# EAGLE design BackscatterPlantSensor_v6_4tssop_coax_2layer (EAGLE 6.4)

## Sheet 1 of 4
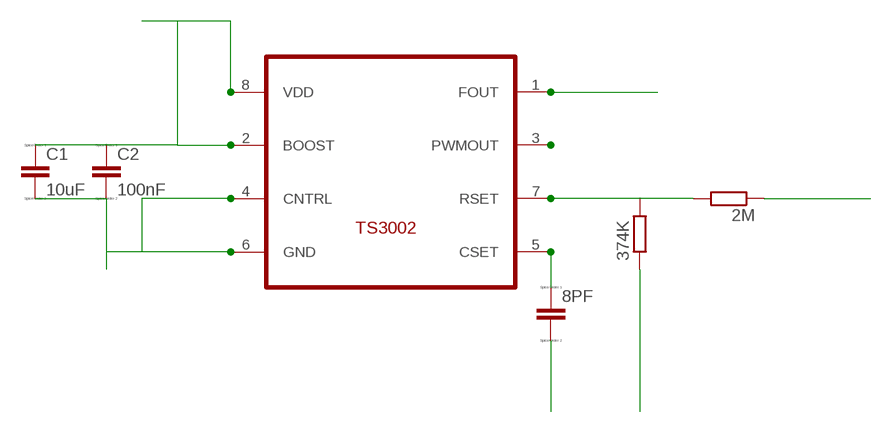
[diagram p0: schematic, sheet 1]

### Parts
2M  R-EU_R0603  [R0603]
8PF  CC0603  [C0603]
374K  R-EU_R0603  [R0603]
C1  10uF  CC0603  [C0603]
C2  100nF  CC0603  [C0603]
U$1  TS3002  [TDFN22-8]

### Nets
AGND: 374K.1 ; also sheet 4
DGND: 8PF.2 C1.2 C2.2 U$1.4(CNTRL) U$1.6(GND) ; also sheet 2
FOUT: U$1.1(FOUT) ; also sheet 2
N$1: 8PF.1 U$1.5(CSET)
N$2: 2M.2 374K.2 U$1.7(RSET)
N$21: U$1.3(PWMOUT)
VCOND1: 2M.1 ; also sheet 4
VDD: C1.1 C2.1 U$1.2(BOOST) U$1.8(VDD) ; also sheet 3,4

## Sheet 2 of 4
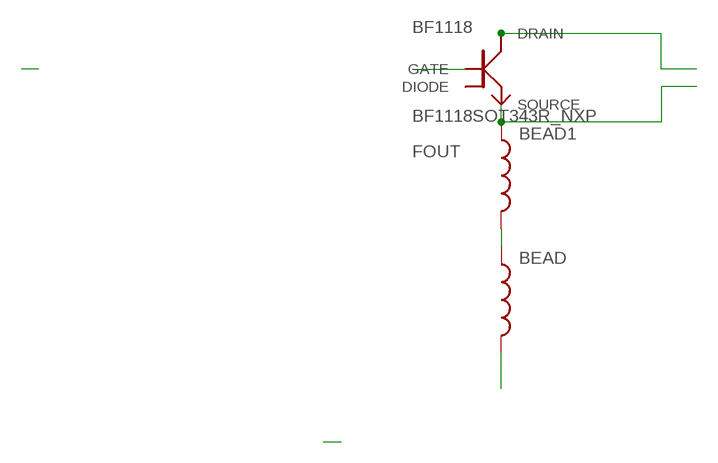
[diagram p1: schematic, sheet 2]

### Parts
BEAD  INDUCTOR0402  [C0402]
BEAD1  INDUCTOR0402  [C0402]
BF1118  BF1118SOT343R_NXP  [SOT343R]

### Nets
DGND: BF1118.1(GATE) ; also sheet 1
FOUT: BEAD.2 ; also sheet 1
N$3: BEAD1.2 BEAD.1
RF_MINUS: BEAD1.1 BF1118.3(SOURCE)
RF_PLUS: BF1118.4(DRAIN)
Unconnected: BF1118.2(DIODE)

## Sheet 3 of 4
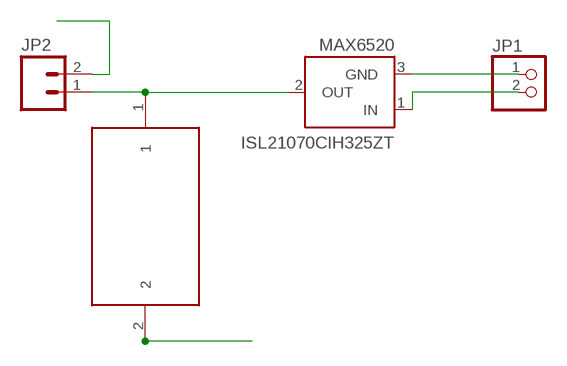
[diagram p2: schematic, sheet 3]

### Parts
ISL21070CIH325ZT  MAX6520  [SOT23]
JP1  PINHD-1X2  [1X02]
JP2  M02PTH  [1X02]
U$2  RVB0E221MNG  [CAP_ELECTROLYTIC]

### Nets
220UF: ISL21070CIH325ZT.2(OUT) JP2.1 U$2.1
GND: ISL21070CIH325ZT.3(GND) JP1.1 U$2.2
N$4: ISL21070CIH325ZT.1(IN) JP1.2
VDD: JP2.2 ; also sheet 1,4

## Sheet 4 of 4
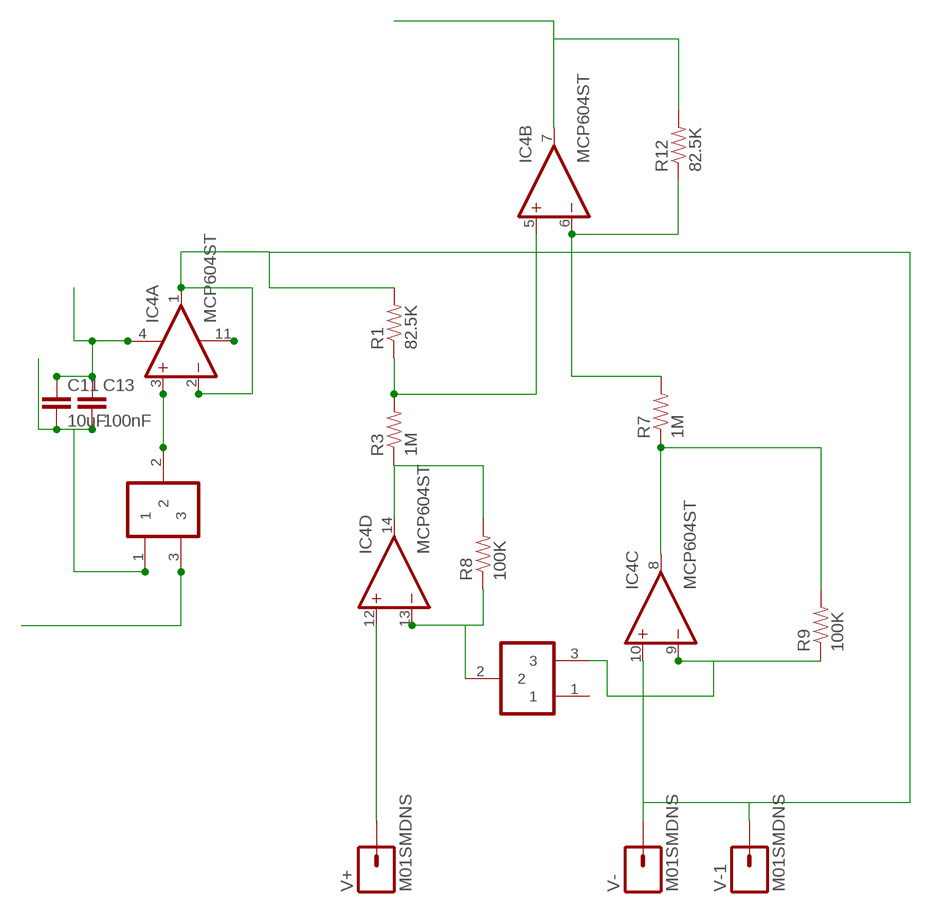
[diagram p3: schematic, sheet 4]

### Parts
C11  10uF  CAP0603-CAP  [0603-CAP]
C13  100nF  CAP0603-CAP  [0603-CAP]
IC4  MCP604ST  [TSSOP14]
R1  82.5K  RESISTOR  [0805]
R3  1M  RESISTOR  [0805]
R7  1M  RESISTOR  [0805]
R8  100K  RESISTOR  [0805]
R9  100K  RESISTOR  [0805]
R12  82.5K  RESISTOR  [0805]
TRIMMER2.2K  MURATA_PVA2A225  [PVATRIMMER]
U$5  MURATA_PVA2A225  [PVATRIMMER]
V+  M01SMDNS  [1X01NS]
V-  M01SMDNS  [1X01NS]
V-1  M01SMDNS  [1X01NS]

### Nets
AGND: C11.2 C13.2 IC4.11(P:V-) U$5.1 ; also sheet 1
N$10: IC4.13(D:-IN) R8.1 TRIMMER2.2K.2
N$100: IC4.9(C:-IN) R9.1 TRIMMER2.2K.3
N$119: IC4.8(C:OUT) R7.1 R9.2
N$125: IC4.14(D:OUT) R3.1 R8.2
N$126: IC4.6(B:-IN) R7.2 R12.1
N$127: IC4.3(A:+IN) U$5.2
N$129: IC4.5(B:+IN) R1.1 R3.2
V+: IC4.12(D:+IN) V+.1
VCOND1: IC4.7(B:OUT) R12.2 ; also sheet 1
VDD: C11.1 C13.1 IC4.4(P:V+) U$5.3 ; also sheet 1,3
VRF: IC4.1(A:OUT) IC4.2(A:-IN) IC4.10(C:+IN) R1.2 V-1.1 V-.1
Unconnected: TRIMMER2.2K.1

## Library data of the parts
2M 374K = rcl:R-EU_: RESISTOR, European symbol
8PF C1 C2 = eagle-ltspice:C: CAPACITOR, European symbol; SPICEMODEL: NONE; SPICEPREFIX: C
BEAD BEAD1 = SparkFun:INDUCTOR: Inductors Basic Inductor/Choke - 0603 and 1206. Footprints are not proven and vary greatly between part numbers.
BF1118 = rf_transistors:BF1118
C11 C13 = SparkFun-Passives:CAP: Capacitor Standard 0603 ceramic capacitor, and 0.1" leaded capacitor.
IC4 = linear:MCP604: Quad Op Amp 2.7V to 6.0V Single Supply CMOS Source: http://ww1.microchip.com/downloads/en/DeviceDoc/21314g.pdf
ISL21070CIH325ZT = maxim:MAX6520: 1.2V Voltage Reference 50ppm/°C, SOT23, 3-Terminal Source: Data sheet <http://datasheets.maxim-ic.com/en/ds/MAX6520.pdf>; MF: MAXIM; MPN: MAX6520EUR-T; OC_FARNELL: unknown; OC_NEWARK: 02J4586
JP1 = pinhead:PINHD-1X2: PIN HEADER
JP2 = SparkFun:M02: Header 2 Standard 2-pin 0.1" header. Use with straight break away headers (SKU : PRT-00116), right angle break away headers (PRT-00553), swiss pins (PRT-00743), machine pins (PRT-00117), and female headers (PRT-00115). Molex polarized connector foot print use with SKU : PRT-08233 with associated crimp pins and housings.
R1 R3 R7-R9 R12 = SparkFun:RESISTOR: Resistor Basic schematic elements and footprints for 0603, 1206, and PTH 1/10th watt (small) resistors.
TRIMMER2.2K U$5 = murata:MURATA_PVA2A225
U$1 = ts3002TDFN22_8pin:TS3002
U$2 = nichicon:RVB0E221MNG
V+ V- V-1 = SparkFun-Connectors:M01: Header 1 Standard 1-pin 0.1" header. Use with straight break away headers (SKU : PRT-00116), right angle break away headers (PRT-00553), swiss pins (PRT-00743), machine pins (PRT-00117), and female headers (PRT-00115).

## Board
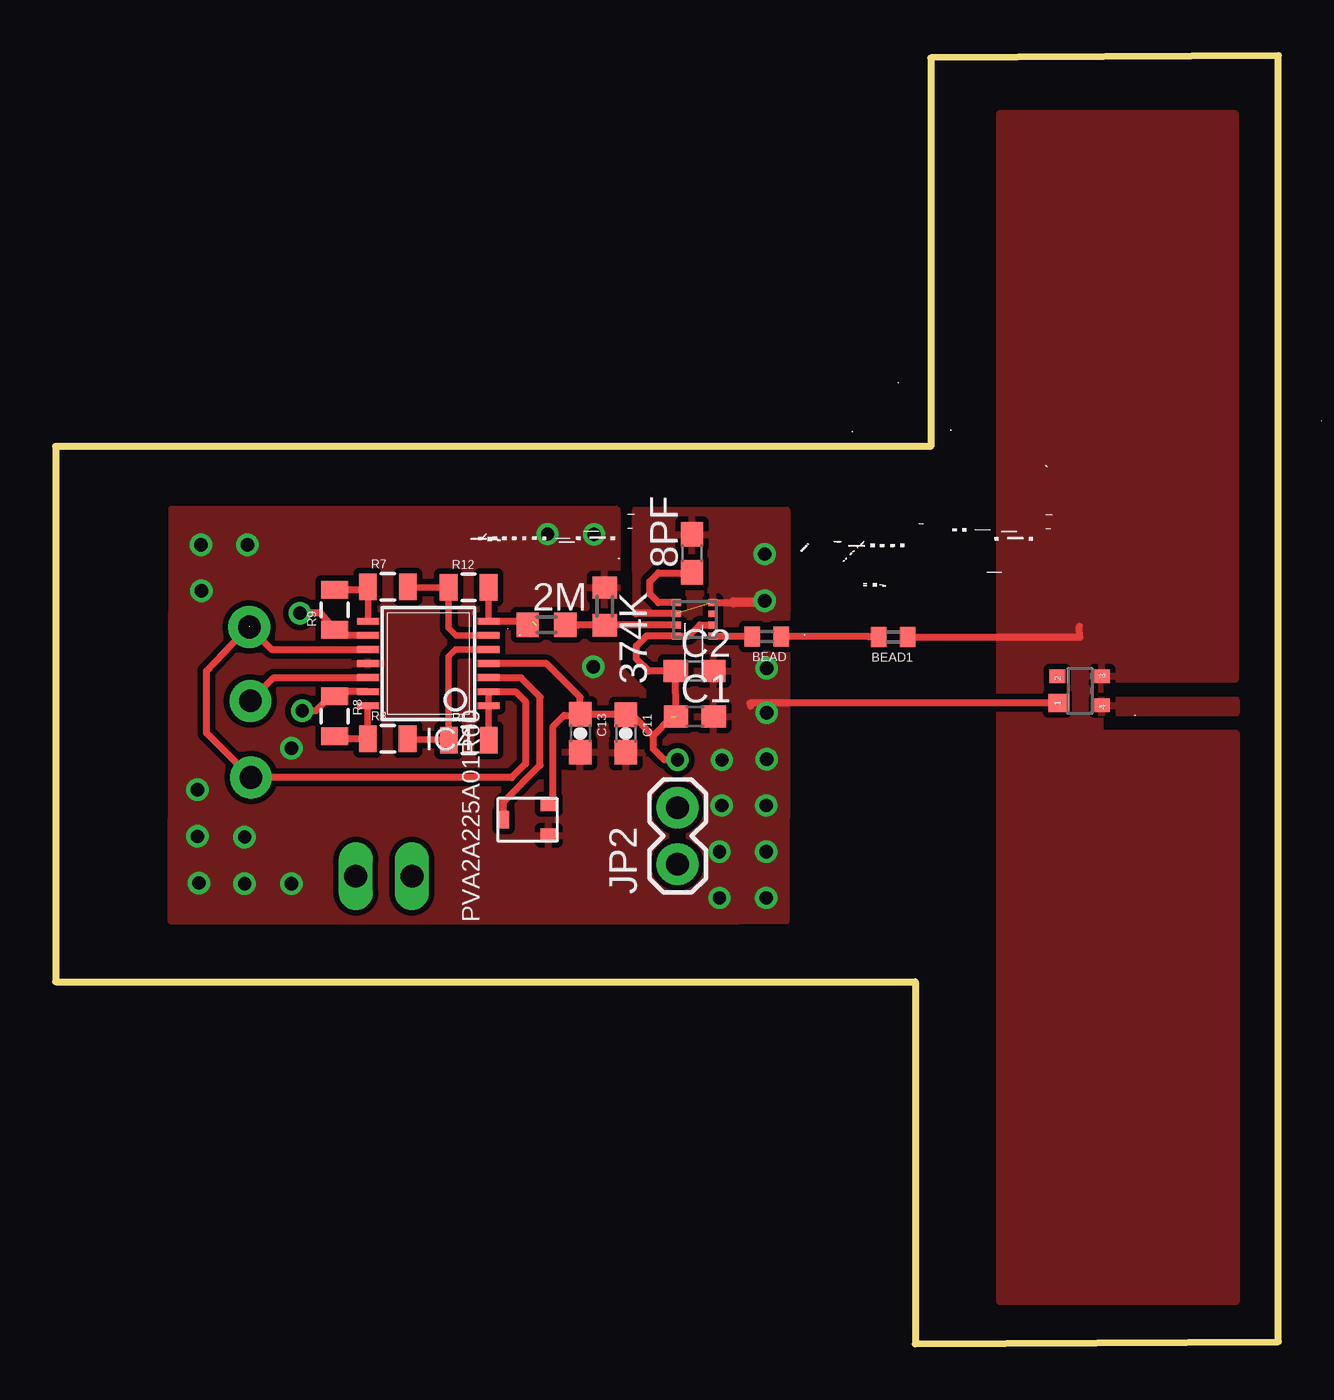
[diagram p4: board, top side]
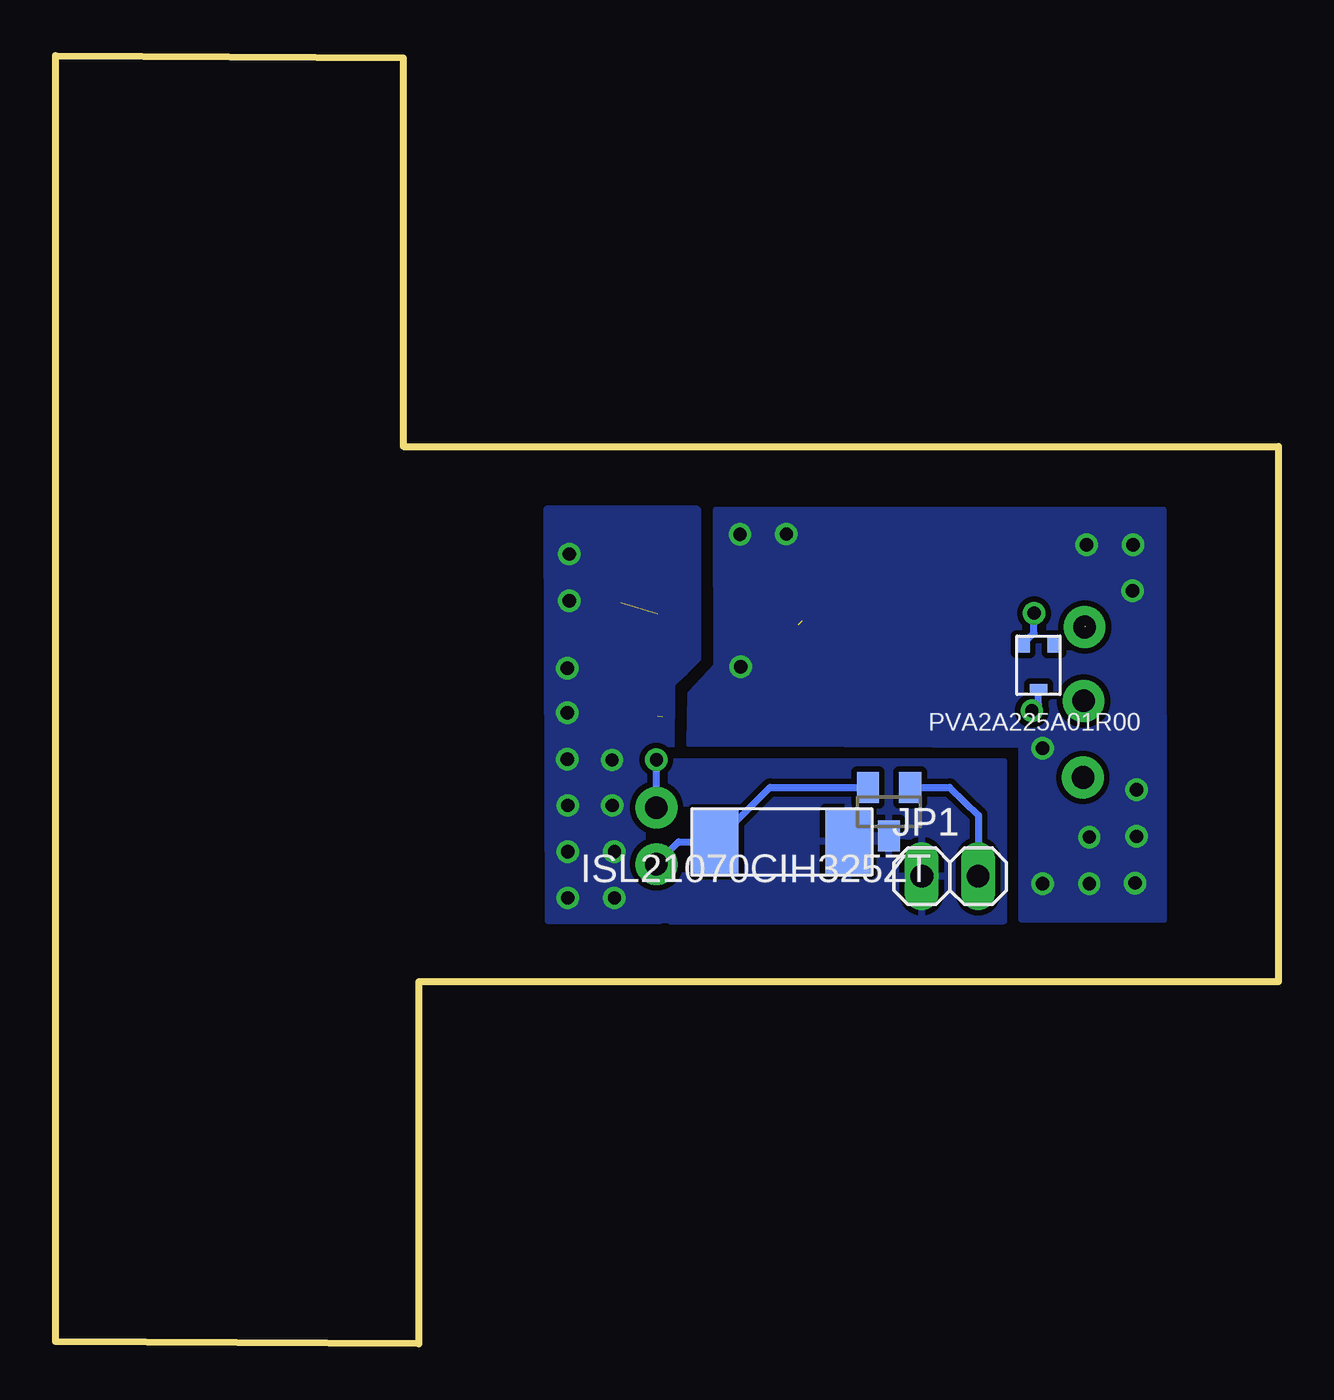
[diagram p5: board, bottom side, seen from below]

Size 55.05 x 58 mm. Coordinates in mm from the lower left corner, seen from the top.
Outline: 39.4,40.4 0,40.4 0,16.3 38.7,16.3 38.7,0 55.05,0.1 55.05,58 39.4,57.9 39.4,40.4
Copper layers (1*16): Top 0.035mm / dielectric 1.5mm / Bottom 0.035mm
Design rules "default *": minimum track width 10mil, minimum drill 24mil, track to track 10mil, track to pad 10mil, pad to pad 10mil, via to via 10mil, smd to smd 10mil, copper to edge 40mil, drill to drill 8mil, minimum pad ring 10mil, minimum via ring 8mil, stop-mask expansion 4mil, vias tented up to drill 0mil, thermal gap 10mil

### Footprints (pad centres in the part's own frame; a part is rotated, then mirrored left to right if it is on the bottom)
R0603 = smd 1 x 1.1: 1 -0.85,0; 2 0.85,0
C0603 = smd 1.1 x 1: 1 -0.85,0; 2 0.85,0
C0402 = smd 0.7 x 0.9: 1 -0.65,0; 2 0.65,0
SOT343R = smd 0.8 x 0.8: 1 0.55,-1.07 | smd 0.6 x 0.7: 2 -0.66,-1.07; 3 -0.66,0.94; 4 0.65,0.94
0603-CAP = smd 1.1 x 1: 1 -0.85,0; 2 0.85,0
TSSOP14 = smd 0.305 x 0.991: 1 -1.905,-2.718; 2 -1.27,-2.718; 3 -0.635,-2.718; 4 0,-2.718; 5 0.635,-2.718; 6 1.27,-2.718; 7 1.905,-2.718; 8 1.905,2.718; 9 1.27,2.718; 10 0.635,2.718; 11 0,2.718; 12 -0.635,2.718; 13 -1.27,2.718; 14 -1.905,2.718
SOT23 = smd 1 x 1.4: 1 -0.95,-1.1; 2 0.95,-1.1; 3 0,1.1
1X02 = drill 1.016 long: 1 -1.27,0; 2 1.27,0
1X02' = drill 1.016 pad 1.88: 1 0,0; 2 2.54,0
0805 = smd 0.8 x 1.2: 1 -0.9,0; 2 0.9,0
PVATRIMMER = smd 0.6 x 0.75: 1 -0.7,-0.9; 3 0.7,-0.9 | smd 0.8 x 0.5: 2 0,1.14
TDFN22-8 = smd 0.408 x 0.306: 1 -1.78,-0.7; 2 -1.78,-1.2; 4 -1.78,-2.2; 5 -0.13,-2.2; 6 -0.13,-1.7; 7 -0.13,-1.2; 8 -0.13,-0.7 | smd 0.407 x 0.306: 3 -1.78,-1.7
CAP_ELECTROLYTIC = smd 2.9 x 2.05: 1 0.1,2.94; 2 0.12,-3.04
1X01NS = drill 1.016 pad 1.88: 1 0,0

### Placement (x,y rotation side)
2M  22.1,32.37 0 top
8PF  28.65,35.59 90 top
374K  24.72,33.21 270 top
BEAD  32.02,31.85 180 top
BEAD1  37.71,31.82 180 top
BF1118  46.17,29.4 270 top
C1  28.78,28.24 0 top
C2  28.77,30.29 0 top
C11  25.67,27.48 270 top
C13  23.62,27.49 270 top
IC4  16.78,30.63 90 top
ISL21070CIH325ZT  17.53,23.96 180 bottom
JP1  14.78,21.05 0 bottom
JP2  [1X02']  28,21.6 90 top
R1  18.6,27.18 0 top
R3  14.95,27.24 0 top
R7  14.96,34.08 0 top
R8  12.56,28.26 270 top
R9  12.56,33.05 90 top
R12  18.59,34.06 0 top
TRIMMER2.2K  10.8,30.6 180 bottom
U$1  27.82,31.17 180 top
U$2  22.4,22.5 90 bottom
U$5  21.3,23.6 90 top
V+  8.77,28.95 0 top
V-  8.72,32.27 270 top
V-1  8.8,25.5 0 top

### Tracks (layer width: path | path; a pad name or v marks a point on that pad's centre or on a via)
220UF
  Bottom 0.305: 25.34,22.3 U$2.1 | U$2.1 22.88,25.06 ISL21070CIH325ZT.2 | JP2.1 27,22.6 U$2.1
AGND  (via drill 0.6)
  other vias: 24.21,30.48 6.38,22.85 6.57,33.91 22.15,36.46 24.24,36.45 6.45,20.75 8.51,20.72 6.55,35.98 8.63,35.98 6.38,24.95 10.61,20.72 8.51,22.82 10.61,26.82
  pour Top: 5.22,37.57 5.19,19.05 28.09,19.04 28.13,25.25 26.5,27.21 26.45,29.39 25.3,30.53 25.29,37.56
  pour Bottom: 25.3,37.56 5.2,37.55 5.18,19.09 11.56,19.12 11.55,26.97 15.53,26.99 23.62,27.02 26.5,27 26.45,29.28 25.28,30.54
DGND  (via drill 0.6)  (1 unrouted)
  Top 0.305: C2.2 29.22,29.94 | U$1.6 26.13,32.87 26.12,32.88 26.12,32.89 26.15,32.92 26.25,32.92 | BF1118.1 31.25,28.85 31.3,28.7 | U$1.4 30.5,33.37 | 30.5,33.4 31.6,33.4 31.6,33.6
  Top 0.406: 30.5,33.37 30.5,33.4 31.7,33.4 31.7,33.7
  other vias: 31.93,33.46 32.01,26.32 31.99,24.24 31.99,22.16 31.99,20.08 31.93,35.56 29.89,20.08 29.89,22.16 29.99,24.24 30,26.29 32.01,28.42 32.01,30.42
  pour Bottom: 26.18,37.53 32.9,37.54 32.84,19.1 27.85,19.09 27.93,25.89 28.73,26.49 27.36,26.49 27.34,29.73 26.78,30.27 26.18,30.87 26.17,31.86
  pour Top: 26.11,37.57 32.92,37.55 32.89,19.04 27.88,19.05 27.98,25.89 28.66,26.47 27.14,26.48 26.12,31.91
FOUT
  Top 0.305: U$1.1 31.35,31.87 BEAD.2
GND
  pour Bottom: 12.35,26.2 27.35,26.2 27.4,19.05 12.35,19.05
JUNC
  pour Top: 26.72,21.33 26.6,19.02 30.7,19.04 30.69,21.4
  pour Bottom: 30.77,19.1 30.74,21.41 26.7,21.36 26.7,19.07
N$1
  Top 0.305: U$1.5 27.14,33.37 26.76,33.75 26.76,34.33 27.14,34.71 28.24,34.71 8PF.1
N$2
  Top 0.305: 374K.2 23.54,32.35 2M.2 | 374K.2 25.61,32.36 | 24.92,32.38 374K.2 | U$1.7 24.94,32.37 374K.2
N$3
  Top 0.305: 32.99,31.86 BEAD.1 36.61,31.85 BEAD1.2
N$4
  Bottom 0.305: ISL21070CIH325ZT.1 14.81,25.06 13.5,23.8 JP1.2
N$10  (via drill 0.6)
  Top 0.305: IC4.13 12.58,29.36 | 12.58,29.36 R8.1 | 12.58,29.36 11.72,28.5 v11.1,28.5
  Bottom 0.305: v11.1,28.5 10.8,28.8 TRIMMER2.2K.2
N$100  (via drill 0.6)
  Top 0.305: IC4.9 12.81,31.9 R9.1 11.91,32.9 v11,32.9
  Bottom 0.305: TRIMMER2.2K.3 11,32 v11,32.9
N$119
  Top 0.3: R7.1 IC4.8
  Top 0.305: IC4.8 | R9.2 13.93,33.95 R7.1
N$125
  Top 0.3: R3.1 IC4.14
  Top 0.305: IC4.14 | R3.1 12.46,27.24 R8.2
N$126
  Top 0.3: R12.1 17.7,32.24 18.04,31.9 IC4.6
  Top 0.305: R7.2 R12.1
N$127
  Top 0.3: IC4.3 20.38,30
  Top 0.305: IC4.3 19.52,29.98 20.96,29.98 21.82,29.12 21.82,26.06 20.16,24.4 U$5.2
N$129
  Top 0.3: R1.1 17.7,30.95 18.01,31.26 19.49,31.26 IC4.5
  Top 0.305: R3.2 17.78,27.22 R1.1
RF_MINUS
  Top 0.305: BEAD1.1 46.12,31.82 46.1,32.3
  pour Top: 53.15,1.9 42.5,1.9 42.5,55.4 53.1,55.4 53.1,29.9 47,29.9 47,27.5 53.15,27.5
RF_PLUS
  pour Top: 46.9,29 53.15,29 53.15,28.4 46.9,28.4
V+
  Top 0.305: V+.1 9.82,30 IC4.12
VCOND1  (1 unrouted)
  Top 0.3: R12.2 IC4.7
  Top 0.305: IC4.7 21.45,32.54 | 21.63,32.37 2M.1
VDD  (via drill 0.6)  (1 unrouted)
  Top 0.305: C1.1 27.93,28.25 C2.1 26.71,30.29 26.15,30.84 26.15,31.43 26.6,31.86 | 26.6,31.86 | 26.6,31.86 26.61,31.87 U$1.8 28.5,31.87 29,32.37 U$1.2 | 19.51,30.64 IC4.4 22.11,30.63 23.62,29.12 C13.1 | C13.1 C11.1 25.95,28.33 26.9,27.37 | 23.24,28.38 C13.1 | 26.9,27.37 27.72,28.22 | U$5.3 22.4,24.5 22.4,27.8 22.9,28.3 23.58,28.3 C13.1 | 26.9,27.37 26.9,26.8 27.4,26.3 v28,26.3
  Bottom 0.305: JP2.2 v28,26.3
VRF  (1 unrouted)
  Top 0.3: 19.49,27.24 IC4.1 IC4.2
  Top 0.305: 19.47,26.9 R1.2 19.49,27.24 | IC4.10 9.72,31.27 V-.1 | IC4.2 20.71,29.36 21.16,28.91 21.16,26.13 20.53,25.5 V-1.1 6.8,27.5 6.8,30.3 8.72,32.32